# Altium schematic sheet RS232.SchDoc
size A4
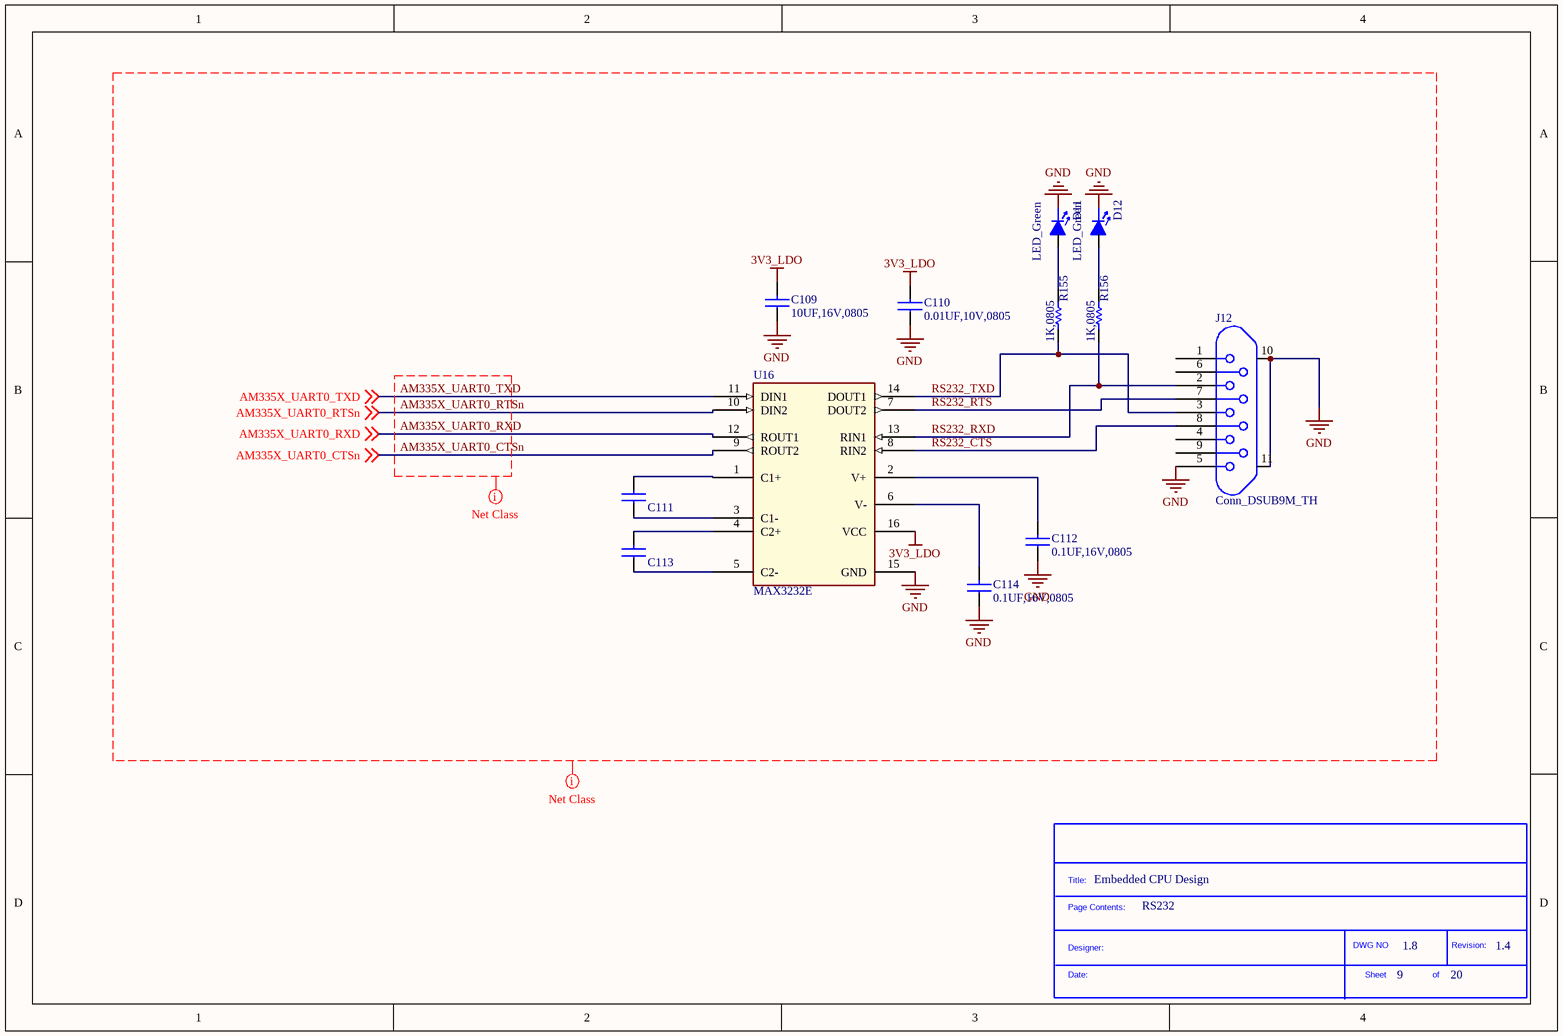
[diagram p0: RS232.SchDoc]

## Parts
*?  SDTitleBlock  (value not drawn)  (graphical)
C109  10UF,16V,0805  [0805]
C110  0.01UF,10V,0805  [0805]
C111  0.1UF,16V,0805  [0805]  (value not drawn)
C112  0.1UF,16V,0805  [0805]
C113  0.1UF,16V,0805  [0805]  (value not drawn)
C114  0.1UF,16V,0805  [0805]
D11  LED_Green  [LED_0805]
D12  LED_Green  [LED_0805]
J12  Conn_DSUB9M_TH  [norcomp_db9m_th]
R155  1K,0805  [0805]
R156  1K,0805  [0805]
U16  MAX3232E  [TI-DW16_M]

## Nets
3V3_LDO: C109.2 C110.2 U16.16(VCC)
GND: C109.1 C110.1 C112.1 C114.1 D11.1(Cathode) D12.1(Cathode) J12.5 J12.10 J12.11 U16.15(GND)
AM335X_UART0_CTSn: U16.9(ROUT2) ; off-sheet AM335X_UART0_CTSn
AM335X_UART0_RTSn: U16.10(DIN2) ; off-sheet AM335X_UART0_RTSn
AM335X_UART0_RXD: U16.12(ROUT1) ; off-sheet AM335X_UART0_RXD
AM335X_UART0_TXD: U16.11(DIN1) ; off-sheet AM335X_UART0_TXD
RS232_CTS: J12.8 U16.8(RIN2)
RS232_RTS: J12.7 U16.7(DOUT2)
RS232_RXD: J12.2 R156.1 U16.13(RIN1)
RS232_TXD: J12.3 R155.1 U16.14(DOUT1)
NetC111_1: C111.1 U16.3(C1-)
NetC111_2: C111.2 U16.1(C1+)
NetC112_2: C112.2 U16.2(V+)
NetC113_1: C113.1 U16.5(C2-)
NetC113_2: C113.2 U16.4(C2+)
NetC114_2: C114.2 U16.6(V-)
NetD11_2: D11.2(Anode) R155.2
NetD12_2: D12.2(Anode) R156.2

Not connected (* = marked no-connect by the designer): J12 1 4 6 9

## Layout directives
net class RS232: AM335X_UART0_CTSn, AM335X_UART0_RTSn, AM335X_UART0_RXD, AM335X_UART0_TXD
net class RS232_P: 3V3_LDO, AM335X_UART0_CTSn, AM335X_UART0_RTSn, AM335X_UART0_RXD, AM335X_UART0_TXD, GND, RS232_CTS, RS232_RTS, RS232_RXD, RS232_TXD

## Notes on the sheet
- Embedded CPU Design
- RS232
- 9
- 1.8
- 20
- 1.4
- (in symbol SDTitleBlock) Title:; Page Contents:; DWG NO; Revision:; Designer:; Date:; Sheet; of

## Library data of the parts
C109 = 10UF,16V,0805: AVX - 0805YD106KAT2A - CAP, MLCC, X5R, 10UF, 16V, 0805; Capacitance: 10; Capacitance Tolerance: ± 10%; Dielectric Characteristic: X5; Voltage Rating: 16; Ceramic Capacitor Case: 0805 [2012 Metric]; SVHC: No SVHC (16-Jun-2014); Capacitor Terminals: SMD; Tolerance: ±10%; Supplier 1: Digi-Key; Manufacturer: AVX; Manufacturer Part Number: 0805YD106KAT2A; RoHS: YES; Stock 1: 779135; Pricing 1: 1=0.25, 10=0.171, 25=0.1244, 100=0.0872, 500=0.06226, 1000=0.05291 (USD); Product Range: -; Operating Temperature Min: -55; Operating Temperature Max: 85; Packaging: Cut Tape; MSL: MSL 1 - Unlimited; Capacitance Tolerance ±: ± 10%; Capacitor Case Style: 0805 [2012 Metric]; Operating Temperature Range: -55°C to +85; Series: MLCC<!--FANDB--><div class="features-and-benefits-container"></div>; ComponentLink1URL: http://www.farnell.com/datasheets/1666675.pdf; ComponentLink1Description: http://www.farnell.com/datasheets/1666675.pdf; ComponentLink2URL: http://www.farnell.com/cad/1614404.zip; ComponentLink2Description: http://www.farnell.com/cad/1614404.zip; Supplier Part Number 1: 1276-1096-1-ND; Category: Capacitors; Voltage - Rated: 16V; Temperature Coefficient: X5R; Mounting Type: Surface Mount, MLCC; Operating Temperature: -55°C ~ 85°C; Applications: General Purpose; Ratings: -; Package / Case: 0805 (2012 Metric); Size / Dimension: 0.079" L x 0.049" W (2.00mm x 1.25mm); Height - Seated (Max): -; Thickness (Max): 0.055" (1.40mm); Lead Spacing: -; Features: -; Lead Style: -; ComponentLink3URL: http://www.samsungsem.com/kr/front/downloadcms.do?path=/kr/support/product-search/mlcc/__icsFiles/afieldfile/2014/11/05&fileName=S_CL21A106KOQNNNE.pdf; ComponentLink3Description: http://www.samsungsem.com/kr/front/downloadcms.do?path=/kr/support/product-search/mlcc/__icsFiles/afieldfile/2014/11/05&fileName=S_CL21A106KOQNNNE.pdf
C110 = 0.01UF,10V,0805: MULTICOMP - MCSH21B103K100CT - CAP, MLCC, X7R, 10NF, 10V, 0805; Capacitance: 10000pF; Tolerance: ±10%; Voltage - Rated: 16V; Supplier 1: Digi-Key; Manufacturer: MULTICOMP; Manufacturer Part Number: MCSH21B103K100CT; RoHS: YES; Stock 1: 21284; Pricing 1: 1=0.24, 10=0.2, 50=0.1126, 100=0.1, 250=0.075, 500=0.06626, 1000=0.05875 (USD); ComponentLink1URL: http://www.farnell.com/datasheets/1825494.pdf; ComponentLink1Description: http://www.farnell.com/datasheets/1825494.pdf; Supplier Part Number 1: 399-7995-1-ND; Category: Capacitors; Packaging: Cut Tape (CT); Temperature Coefficient: X7R; Mounting Type: Surface Mount, MLCC; Operating Temperature: -55°C ~ 125°C; Applications: General Purpose; Ratings: -; Package / Case: 0805 (2012 Metric); Size / Dimension: 0.079" L x 0.049" W (2.00mm x 1.25mm); Height - Seated (Max): -; Thickness (Max): 0.035" (0.88mm); Lead Spacing: -; Features: -; Lead Style: -; ComponentLink2URL: http://www.kemet.com/docfinder?Partnumber=C0805C103K4RACTU; ComponentLink2Description: http://www.kemet.com/docfinder?Partnumber=C0805C103K4RACTU
C111-C114 = 0.1UF,16V,0805: AVX - 0805YC104KAT2A - CAP, MLCC, X7R, 100NF, 16V, 0805; Capacitance: 0.1; Capacitance Tolerance: ± 10%; Dielectric Characteristic: X7; Voltage Rating: 16; Ceramic Capacitor Case: 0805 [2012 Metric]; SVHC: No SVHC (16-Jun-2014); Capacitor Case Style: 0805 [2012 Metric]<!--FANDB--><div class="features-and-benefits-container"></div>; Tolerance: ±10%; Supplier 1: Digi-Key; Manufacturer: AVX; Manufacturer Part Number: 0805YC104KAT2A; RoHS: YES; Stock 1: 9101; Pricing 1: 1=0.29, 10=0.198, 100=0.1008, 250=0.0816, 500=0.072, 1000=0.0612 (USD); Product Range: -; Operating Temperature Min: -55; Operating Temperature Max: 125; Packaging: Cut Tape; MSL: MSL 1 - Unlimited; Capacitance Tolerance ±: ± 10%; ComponentLink1URL: http://www.farnell.com/datasheets/1679506.pdf; ComponentLink1Description: http://www.farnell.com/datasheets/1679506.pdf; Supplier Part Number 1: 478-7961-1-ND; Category: Capacitors; Voltage - Rated: 16V; Temperature Coefficient: X7R; Mounting Type: Surface Mount, MLCC; Operating Temperature: -55°C ~ 125°C; Applications: General Purpose; Ratings: -; Package / Case: 0805 (2012 Metric); Size / Dimension: 0.079" L x 0.049" W (2.00mm x 1.25mm); Height - Seated (Max): -; Thickness (Max): 0.037" (0.94mm); Lead Spacing: -; Features: -; Lead Style: -; ComponentLink2URL: http://www.avx.com/docs/Catalogs/cx7r.pdf; ComponentLink2Description: http://www.avx.com/docs/Catalogs/cx7r.pdf
D11 D12 = LED_Green: LED Green SMD 20mA 2V 0805; TIIntPartnumber: 1F0008; MfrNum: 598-8170-107F; Mfr: Dialight; PartName: LEDGreen2x1.5; Cost10K: 0.052; Cost100: 0.081; Vendor: Digikey; Wavelength - Dominant: 566nm; Millicandela Rating: 20mcd; Viewing Angle: 140°; Lens Type: Clear; Lens Style/Size: Rectangle with Flat Top, 1.4mm x 1.25mm; DescriptiveText: LED Green SMD 20mA 2V 0805; Descriptive_Text: LED Green SMD 20mA 2V 0805; Supplier 1: Digi-Key; Manufacturer: Dialight; Manufacturer Part Number: 598-8170-107F; RoHS: RoHS Compliant; Category: Optoelectronics; Stock 1: 91030; Pricing 1: 1=0.42, 10=0.31, 25=0.248, 100=0.1643, 250=0.1364, 500=0.0992, 1000=0.0775 (USD); Packaging: Cut Tape (CT); Color: Green; Wavelength - Peak: -; Voltage - Forward (Vf) (Typ): 2V; Current - Test: 20mA; Package / Case: 0805 (2012 Metric); Size / Dimension: 2.00mm L x 1.25mm W; Height: 0.70mm; Mounting Type: Surface Mount; Luminous Flux @ Current - Test: -; ComponentLink1URL: http://media.digikey.com/pdf/Data%20Sheets/Dialight%20PDFs/598_Series_0805_Pkg.pdf; ComponentLink1Description: http://media.digikey.com/pdf/Data%20Sheets/Dialight%20PDFs/598_Series_0805_Pkg.pdf; Supplier Part Number 1: 350-2044-1-ND
J12 = Conn_DSUB9M_TH: TIIntPartnumber: 2C0098; MfrNum: 182-009-113R531; Mfr: Norcomp; PartName: Conn_DSub9MTH; Cost10K: 0.82; Cost100: 1.20; Vendor: Digikey; DescriptiveText: Connector DB9 Male RA Throughhole
R155 R156 = 1K,0805: BOURNS - CR0805-FX-1001ELF - RESISTOR, 1K, 0.125W, 1%; Product Range: BOURNS - CR Series; Resistance: 1; Power Rating: 125; Resistor Case Style: 0805 [2012 Metric]; Resistor Element Material: Thick Film; Temperature Coefficient: ± 100; Voltage Rating: 150; SVHC: No SVHC (16-Jun-2014); Resistor Mounting: SMD<!--FANDB--><div class="features-and-benefits-container"></div>; Power (Watts): 0.125W, 1/8W; Manufacturer: BOURNS; Manufacturer Part Number: CR0805-FX-1001ELF; RoHS: YES; Resistance Tolerance: ± 1%; Packaging: Cut Tape; MSL: MSL 1 - Unlimited; ComponentLink1URL: http://www.farnell.com/datasheets/1845293.pdf; ComponentLink1Description: http://www.farnell.com/datasheets/1845293.pdf; Supplier 1: Digi-Key; Category: Resistors; Stock 1: 2060902; Pricing 1: 1=0.1, 50=0.0288, 100=0.0219, 250=0.01624, 500=0.012, 1000=0.008, 2500=0.00675 (USD); Resistance (Ohms): 1k; Tolerance: ±1%; Composition: Thick Film; Features: Automotive AEC-Q200; Operating Temperature: -55°C ~ 155°C; Package / Case: 0805 (2012 Metric); Supplier Device Package: 0805; Size / Dimension: 0.079" L x 0.049" W (2.00mm x 1.25mm); Height: 0.028" (0.70mm); Number of Terminations: 2; ComponentLink2URL: http://industrial.panasonic.com/www-cgi/jvcr13pz.cgi?E+PZ+3+AOA0002+ERJ6ENF1001V+7+WW; ComponentLink2Description: http://industrial.panasonic.com/www-cgi/jvcr13pz.cgi?E+PZ+3+AOA0002+ERJ6ENF1001V+7+WW; Supplier Part Number 1: P1.00KCCT-ND
U16 = MAX3232E: Dual Channel RS-232 Line Driver/Receiver; TIIntPartnumber: 1A0213; MfrNum: MAX3232ECD; Mfr: TI; Manufacturer: Texas Instruments; Manufacturer Part Number: MAX3232CDWR; Cost10K: 0.81; Cost100: 1.47; Vendor: Digikey; Protocol: RS232; Number of Drivers/Receivers: 2/2; Duplex: Full; Receiver Hysteresis: 300mV; Data Rate: 250kbps; Voltage - Supply: 3 V ~ 5.5 V; DescriptiveText: Dual Channel RS-232 Line Driver/Receiver; PartName: MAX3232E; Descriptive_Text: Dual Channel RS-232 Line Driver/Receiver; Supplier 1: Digi-Key; Supplier Part Number 1: 296-13095-1-ND; RoHS: RoHS Compliant; Category: Integrated Circuits (ICs); Stock 1: 4145; Pricing 1: 1=1.91, 10=1.728, 25=1.548, 100=1.392, 250=1.236, 500=1.08, 750=0.978, 1000=0.894 (USD); Packaging: Cut Tape (CT); Type: Transceiver; Operating Temperature: 0°C ~ 70°C; Mounting Type: Surface Mount; Package / Case: 16-SOIC (0.295", 7.50mm Width); Supplier Device Package: 16-SOIC; ComponentLink1URL: http://www.ti.com/lit/ds/symlink/max3232.pdf; ComponentLink1Description: http://www.ti.com/lit/ds/symlink/max3232.pdf